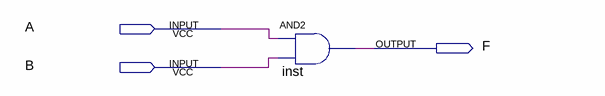
[diagram p0: schematic sheet]
// Quartus schematic andGate.bdf as structural Verilog: 1 symbols, 3 pins
module andGate (
  input  A,
  input  B,
  output F
);

  and inst (F, A, B);
endmodule
